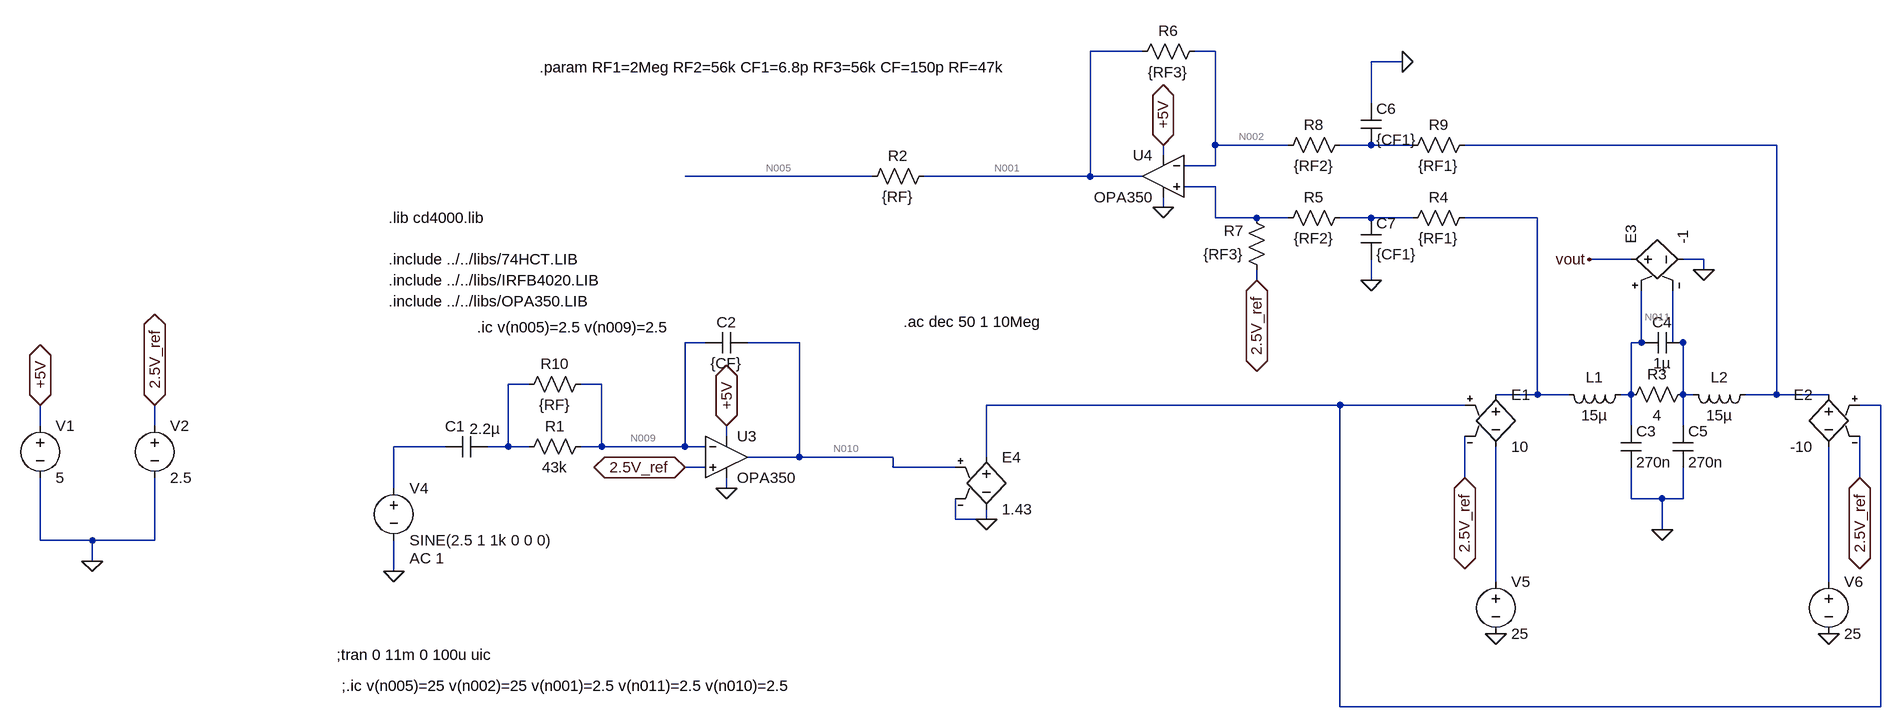
[diagram p0: schematic linear_model_ol.asc]
linear_model_ol.asc, the LTspice schematic file:
Version 4
SHEET 1 2084 960
WIRE 560 -352 480 -352
WIRE 672 -352 640 -352
WIRE 960 -336 912 -336
WIRE 912 -272 912 -336
WIRE 672 -208 672 -352
WIRE 784 -208 672 -208
WIRE 912 -208 864 -208
WIRE 976 -208 912 -208
WIRE 1536 -208 1056 -208
WIRE 592 -192 592 -208
WIRE 672 -176 672 -208
WIRE 672 -176 624 -176
WIRE 144 -160 -144 -160
WIRE 480 -160 480 -352
WIRE 480 -160 224 -160
WIRE 560 -160 480 -160
WIRE 672 -144 624 -144
WIRE 592 -112 592 -128
WIRE 672 -96 672 -144
WIRE 736 -96 672 -96
WIRE 784 -96 736 -96
WIRE 912 -96 864 -96
WIRE 976 -96 912 -96
WIRE 1168 -96 1056 -96
WIRE 1312 -32 1248 -32
WIRE 1424 -32 1392 -32
WIRE 1424 -16 1424 -32
WIRE 736 0 736 -16
WIRE 912 0 912 -32
WIRE -112 96 -144 96
WIRE 32 96 -48 96
WIRE 1328 96 1328 16
WIRE 1328 96 1312 96
WIRE 1376 96 1376 16
WIRE 1392 96 1376 96
WIRE -384 160 -416 160
WIRE -272 160 -304 160
WIRE 1168 176 1168 -96
WIRE 1168 176 1104 176
WIRE 1216 176 1168 176
WIRE 1312 176 1312 96
WIRE 1312 176 1296 176
WIRE 1392 176 1392 96
WIRE 1408 176 1392 176
WIRE 1536 176 1536 -208
WIRE 1536 176 1488 176
WIRE 1616 176 1536 176
WIRE 864 192 320 192
WIRE 1056 192 864 192
WIRE 1696 192 1664 192
WIRE -1136 224 -1136 192
WIRE -960 224 -960 192
WIRE 1312 224 1312 176
WIRE 1392 224 1392 176
WIRE -80 240 -80 224
WIRE -512 256 -592 256
WIRE -416 256 -416 160
WIRE -416 256 -448 256
WIRE -384 256 -416 256
WIRE -272 256 -272 160
WIRE -272 256 -304 256
WIRE -144 256 -144 96
WIRE -144 256 -272 256
WIRE -112 256 -144 256
WIRE 32 272 32 96
WIRE 32 272 -48 272
WIRE 176 272 32 272
WIRE 320 272 320 192
WIRE -112 288 -144 288
WIRE 176 288 176 272
WIRE 272 288 176 288
WIRE 1056 304 1056 240
WIRE 1664 304 1664 240
WIRE -592 320 -592 256
WIRE -80 320 -80 304
WIRE 1312 336 1312 288
WIRE 1360 336 1312 336
WIRE 1392 336 1392 288
WIRE 1392 336 1360 336
WIRE 272 368 272 336
WIRE 320 368 320 352
WIRE 320 368 272 368
WIRE 1360 384 1360 336
WIRE -1136 400 -1136 304
WIRE -1056 400 -1136 400
WIRE -960 400 -960 304
WIRE -960 400 -1056 400
WIRE -1056 432 -1056 400
WIRE -592 448 -592 400
WIRE 1104 464 1104 256
WIRE 1616 464 1616 256
WIRE 864 656 864 192
WIRE 1696 656 1696 192
WIRE 1696 656 864 656
FLAG 1360 384 0
FLAG -1136 192 +5V
IOPIN -1136 192 BiDir
FLAG -960 192 2.5V_ref
IOPIN -960 192 BiDir
FLAG -1056 432 0
FLAG -592 448 0
FLAG -80 224 +5V
IOPIN -80 224 BiDir
FLAG -80 320 0
FLAG -144 288 2.5V_ref
IOPIN -144 288 BiDir
FLAG 592 -208 +5V
IOPIN 592 -208 BiDir
FLAG 592 -112 0
FLAG 736 0 2.5V_ref
IOPIN 736 0 BiDir
FLAG 960 -336 0
FLAG 912 0 0
FLAG 1104 544 0
FLAG 1616 544 0
FLAG 1056 304 2.5V_ref
IOPIN 1056 304 BiDir
FLAG 1664 304 2.5V_ref
IOPIN 1664 304 BiDir
FLAG 1424 -16 0
FLAG 1248 -32 vout
FLAG 320 368 0
SYMBOL cap -448 240 R90
WINDOW 0 0 50 VBottom 2
WINDOW 3 -27 4 VTop 2
SYMATTR InstName C1
SYMATTR Value 2.2µ
SYMBOL ind 1312 160 R90
WINDOW 0 5 56 VBottom 2
WINDOW 3 32 56 VTop 2
SYMATTR InstName L1
SYMATTR Value 15µ
SYMBOL ind 1392 160 M90
WINDOW 0 5 56 VBottom 2
WINDOW 3 32 56 VTop 2
SYMATTR InstName L2
SYMATTR Value 15µ
SYMBOL res 1408 160 R90
WINDOW 0 0 56 VBottom 2
WINDOW 3 32 56 VTop 2
SYMATTR InstName R3
SYMATTR Value 4
SYMATTR SpiceLine tol=10 pwr=500
SYMBOL cap 1296 224 R0
SYMATTR InstName C3
SYMATTR Value 270n
SYMBOL cap 1392 80 R90
WINDOW 0 0 32 VBottom 2
WINDOW 3 32 32 VTop 2
SYMATTR InstName C4
SYMATTR Value 1µ
SYMATTR SpiceLine V=50 Irms=0 Rser=0.008 Lser=0
SYMBOL cap 1376 224 R0
SYMATTR InstName C5
SYMATTR Value 270n
SYMBOL e 1104 160 R0
SYMATTR InstName E1
SYMATTR Value 10
SYMBOL e 1616 160 M0
SYMATTR InstName E2
SYMATTR Value -10
SYMBOL voltage -1136 208 R0
WINDOW 123 0 0 Left 2
WINDOW 39 0 0 Left 2
SYMATTR InstName V1
SYMATTR Value 5
SYMBOL voltage -960 208 R0
WINDOW 123 0 0 Left 2
WINDOW 39 0 0 Left 2
SYMATTR InstName V2
SYMATTR Value 2.5
SYMBOL voltage -592 304 R0
WINDOW 123 24 124 Left 2
WINDOW 39 0 0 Left 2
SYMATTR Value2 AC 1
SYMATTR InstName V4
SYMATTR Value SINE(2.5 1 1k 0 0 0)
SYMBOL Opamps\\opamp2 -80 208 R0
SYMATTR InstName U3
SYMATTR Value OPA350
SYMBOL cap -48 80 R90
WINDOW 0 0 32 VBottom 2
WINDOW 3 32 32 VTop 2
SYMATTR InstName C2
SYMATTR Value {CF}
SYMBOL res -288 240 R90
WINDOW 0 0 56 VBottom 2
WINDOW 3 32 56 VTop 2
SYMATTR InstName R1
SYMATTR Value 43k
SYMBOL Opamps\\opamp2 592 -224 M0
SYMATTR InstName U4
SYMATTR Value OPA350
SYMBOL cap 896 -272 R0
SYMATTR InstName C6
SYMATTR Value {CF1}
SYMBOL cap 896 -96 R0
SYMATTR InstName C7
SYMATTR Value {CF1}
SYMBOL res 240 -176 R90
WINDOW 0 0 56 VBottom 2
WINDOW 3 32 56 VTop 2
SYMATTR InstName R2
SYMATTR Value {RF}
SYMBOL res 1072 -112 R90
WINDOW 0 0 56 VBottom 2
WINDOW 3 32 56 VTop 2
SYMATTR InstName R4
SYMATTR Value {RF1}
SYMBOL res 880 -112 R90
WINDOW 0 0 56 VBottom 2
WINDOW 3 32 56 VTop 2
SYMATTR InstName R5
SYMATTR Value {RF2}
SYMBOL res 656 -368 R90
WINDOW 0 0 56 VBottom 2
WINDOW 3 32 56 VTop 2
SYMATTR InstName R6
SYMATTR Value {RF3}
SYMBOL res 752 0 R180
WINDOW 0 36 76 Left 2
WINDOW 3 36 40 Left 2
SYMATTR InstName R7
SYMATTR Value {RF3}
SYMBOL res 880 -224 R90
WINDOW 0 0 56 VBottom 2
WINDOW 3 32 56 VTop 2
SYMATTR InstName R8
SYMATTR Value {RF2}
SYMBOL res 1072 -224 R90
WINDOW 0 0 56 VBottom 2
WINDOW 3 32 56 VTop 2
SYMATTR InstName R9
SYMATTR Value {RF1}
SYMBOL voltage 1104 448 R0
WINDOW 123 0 0 Left 2
WINDOW 39 0 0 Left 2
SYMATTR InstName V5
SYMATTR Value 25
SYMBOL voltage 1616 448 R0
WINDOW 123 0 0 Left 2
WINDOW 39 0 0 Left 2
SYMATTR InstName V6
SYMATTR Value 25
SYMBOL e 1296 -32 R270
SYMATTR InstName E3
SYMATTR Value -1
SYMBOL e 320 256 R0
SYMATTR InstName E4
SYMATTR Value 1.43
SYMBOL res -288 144 R90
WINDOW 0 0 56 VBottom 2
WINDOW 3 32 56 VTop 2
SYMATTR InstName R10
SYMATTR Value {RF}
TEXT -600 -32 Left 2 !.include ../../libs/74HCT.LIB
TEXT -600 0 Left 2 !.include ../../libs/IRFB4020.LIB
TEXT -600 32 Left 2 !.include ../../libs/OPA350.LIB
TEXT -680 576 Left 2 !;tran 0 11m 0 100u uic
TEXT -600 -96 Left 2 !.lib cd4000.lib
TEXT -672 624 Left 2 !;.ic v(n005)=25 v(n002)=25 v(n001)=2.5 v(n011)=2.5 v(n010)=2.5
TEXT -368 -328 Left 2 !.param RF1=2Meg RF2=56k CF1=6.8p RF3=56k CF=150p RF=47k
TEXT 192 64 Left 2 !.ac dec 50 1 10Meg
TEXT -464 72 Left 2 !.ic v(n005)=2.5 v(n009)=2.5

The netlist it stands for:
* linear_model_ol.asc
C1 N013 N015 2.2µ
L1 N011 N008 15µ
L2 N012 N004 15µ
R3 N012 N011 4 tol=10 pwr=500
C3 N011 0 270n
C4 N012 N011 1µ V=50 Irms=0 Rser=0.008 Lser=0
C5 N012 0 270n
E1 N008 N016 N014 2.5V_ref 10
E2 N004 N017 N014 2.5V_ref -10
V1 +5V 0 5
V2 2.5V_ref 0 2.5
V4 N015 0 SINE(2.5 1 1k 0 0 0) AC 1
XU3 2.5V_ref N009 +5V 0 N010 OPA350  ; pins In+ In- V+ V- OUT
C2 N010 N009 {CF}
R1 N009 N013 43k
XU4 N006 N002 +5V 0 N001 OPA350  ; pins In+ In- V+ V- OUT
C6 0 N003 {CF1}
C7 N007 0 {CF1}
R2 N001 N005 {RF}
R4 N008 N007 {RF1}
R5 N007 N006 {RF2}
R6 N002 N001 {RF3}
R7 2.5V_ref N006 {RF3}
R8 N003 N002 {RF2}
R9 N004 N003 {RF1}
V5 N016 0 25
V6 N017 0 25
E3 vout 0 N011 N012 -1
E4 N014 0 N010 0 1.43
R10 N009 N013 {RF}
.include ../../libs/74HCT.LIB
.include ../../libs/IRFB4020.LIB
.include ../../libs/OPA350.LIB
;tran 0 11m 0 100u uic
.lib cd4000.lib
;.ic v(n005)=25 v(n002)=25 v(n001)=2.5 v(n011)=2.5 v(n010)=2.5
.param RF1=2Meg RF2=56k CF1=6.8p RF3=56k CF=150p RF=47k
.ac dec 50 1 10Meg
.ic v(n005)=2.5 v(n009)=2.5
.backanno
.end